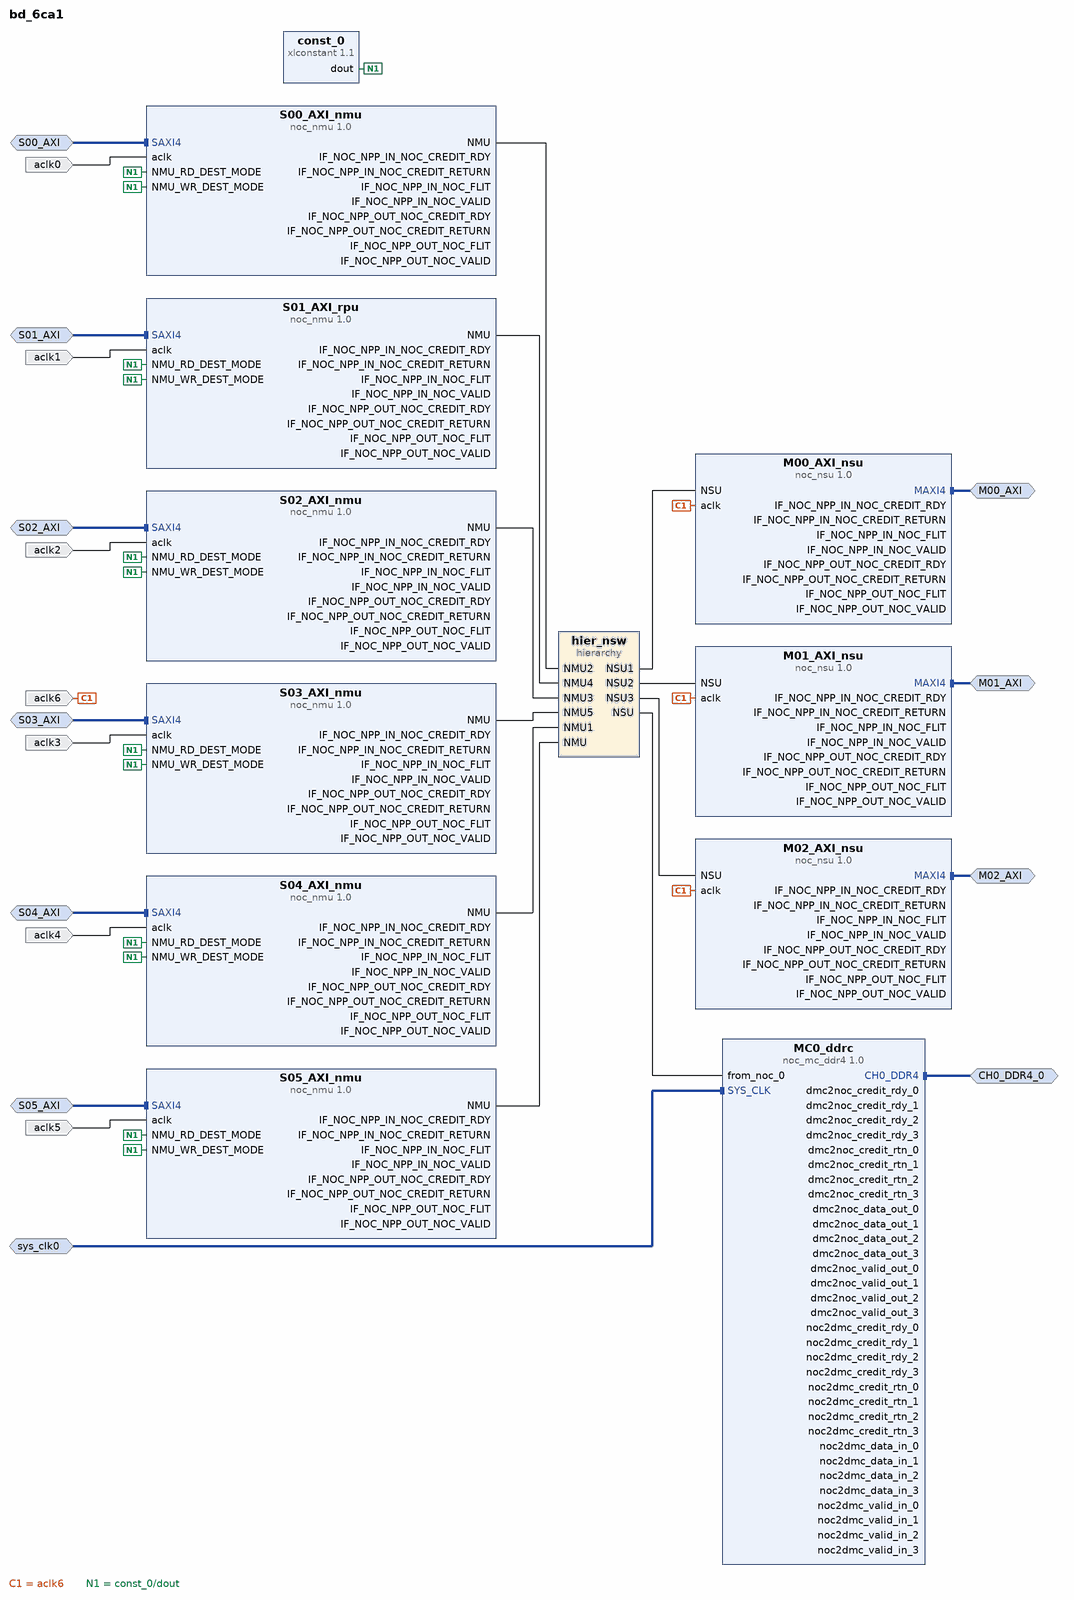
[diagram p0: block diagram of the top level]
# Vivado block design bd_6ca1, xcvc1902-vsva2197-2MP-e-S, Vivado 2021.1
create_bd_design bd_6ca1

create_bd_intf_port -mode Slave -vlnv xilinx.com:interface:aximm_rtl:1.0 S00_AXI
set_property -dict [list \
  CONFIG.CATEGORY ps_pmc \
  CONFIG.CONNECTIONS {MC_0 { read_bw {5} write_bw {5} read_avg_burst {4} write_avg_burst {4}} M00_AXI { read_bw {5} write_bw {5}}  M00_AXI {read_bw {5} write_bw {5}}} \
  CONFIG.DATA_WIDTH 128 \
  CONFIG.DEST_IDS M00_AXI:0x0 \
] [get_bd_intf_ports S00_AXI]
create_bd_intf_port -mode Slave -vlnv xilinx.com:interface:aximm_rtl:1.0 S01_AXI
set_property -dict [list \
  CONFIG.CATEGORY ps_rpu \
  CONFIG.CONNECTIONS {MC_0 { read_bw {5} write_bw {5} read_avg_burst {4} write_avg_burst {4}} } \
  CONFIG.DATA_WIDTH 128 \
] [get_bd_intf_ports S01_AXI]
create_bd_intf_port -mode Slave -vlnv xilinx.com:interface:aximm_rtl:1.0 S02_AXI
set_property -dict [list \
  CONFIG.CATEGORY ps_cci \
  CONFIG.CONNECTIONS {MC_0 { read_bw {5} write_bw {5} read_avg_burst {4} write_avg_burst {4}} M01_AXI { read_bw {5} write_bw {5} read_avg_burst {4} write_avg_burst {4}}  M02_AXI {read_bw {5} write_bw {5}}} \
  CONFIG.DATA_WIDTH 128 \
  CONFIG.DEST_IDS M01_AXI:0x40:M02_AXI:0x80 \
] [get_bd_intf_ports S02_AXI]
create_bd_intf_port -mode Slave -vlnv xilinx.com:interface:aximm_rtl:1.0 S03_AXI
set_property -dict [list \
  CONFIG.CATEGORY ps_cci \
  CONFIG.CONNECTIONS {MC_0 { read_bw {5} write_bw {5} read_avg_burst {4} write_avg_burst {4}} } \
  CONFIG.DATA_WIDTH 128 \
] [get_bd_intf_ports S03_AXI]
create_bd_intf_port -mode Slave -vlnv xilinx.com:interface:aximm_rtl:1.0 S04_AXI
set_property -dict [list \
  CONFIG.CATEGORY ps_cci \
  CONFIG.CONNECTIONS {MC_0 { read_bw {5} write_bw {5} read_avg_burst {4} write_avg_burst {4}} } \
  CONFIG.DATA_WIDTH 128 \
] [get_bd_intf_ports S04_AXI]
create_bd_intf_port -mode Slave -vlnv xilinx.com:interface:aximm_rtl:1.0 S05_AXI
set_property -dict [list \
  CONFIG.CATEGORY ps_cci \
  CONFIG.CONNECTIONS {MC_0 { read_bw {5} write_bw {5} read_avg_burst {4} write_avg_burst {4}} } \
  CONFIG.DATA_WIDTH 128 \
] [get_bd_intf_ports S05_AXI]
create_bd_intf_port -mode Master -vlnv xilinx.com:interface:aximm_rtl:1.0 M00_AXI
set_property -dict {CONFIG.APERTURES {{0x201_0000_0000 1G}} CONFIG.CATEGORY pl CONFIG.DATA_WIDTH 128} [get_bd_intf_ports M00_AXI]
create_bd_intf_port -mode Master -vlnv xilinx.com:interface:aximm_rtl:1.0 M01_AXI
set_property -dict {CONFIG.APERTURES {{0x201_4000_0000 1G}} CONFIG.CATEGORY pl CONFIG.DATA_WIDTH 32} [get_bd_intf_ports M01_AXI]
create_bd_intf_port -mode Master -vlnv xilinx.com:interface:aximm_rtl:1.0 M02_AXI
set_property -dict {CONFIG.APERTURES {{0x201_C000_0000 1G}} CONFIG.CATEGORY pl CONFIG.DATA_WIDTH 32} [get_bd_intf_ports M02_AXI]
create_bd_intf_port -mode Slave -vlnv xilinx.com:interface:diff_clock_rtl:1.0 sys_clk0
create_bd_intf_port -mode Master -vlnv xilinx.com:interface:ddr4_rtl:1.0 CH0_DDR4_0
create_bd_port -dir I -type clk aclk0
set_property -dict {CONFIG.ASSOCIATED_BUSIF S00_AXI} [get_bd_ports aclk0]
create_bd_port -dir I -type clk aclk1
set_property -dict {CONFIG.ASSOCIATED_BUSIF S01_AXI} [get_bd_ports aclk1]
create_bd_port -dir I -type clk aclk2
set_property -dict {CONFIG.ASSOCIATED_BUSIF S02_AXI} [get_bd_ports aclk2]
create_bd_port -dir I -type clk aclk3
set_property -dict {CONFIG.ASSOCIATED_BUSIF S03_AXI} [get_bd_ports aclk3]
create_bd_port -dir I -type clk aclk4
set_property -dict {CONFIG.ASSOCIATED_BUSIF S04_AXI} [get_bd_ports aclk4]
create_bd_port -dir I -type clk aclk5
set_property -dict {CONFIG.ASSOCIATED_BUSIF S05_AXI} [get_bd_ports aclk5]
create_bd_port -dir I -type clk aclk6
set_property -dict {CONFIG.ASSOCIATED_BUSIF M00_AXI:M01_AXI:M02_AXI} [get_bd_ports aclk6]

create_bd_cell -type ip -vlnv xilinx.com:ip:noc_nmu:1.0 S05_AXI_nmu
set_property -dict [list \
  CONFIG.ATTR_FILE nocattrs.dat \
  CONFIG.NOC_FREQ 1000 \
  CONFIG.USER_NOC_CATEGORY PS \
  CONFIG.USER_NOC_DATA512_WIDTH 128 \
  CONFIG.USER_NOC_NMU_WIDTH 128 \
  CONFIG.USER_PHYS_NAME NOC_NMU128_X0Y9 \
  CONFIG.USER_REG_ADDR_DST0 0x0000 \
  CONFIG.USER_REG_ADDR_DST1 0x0000 \
  CONFIG.USER_REG_ADDR_DST2 0x0000 \
  CONFIG.USER_REG_ADDR_DST3 0x0000 \
  CONFIG.USER_REG_ADDR_DST4 0x0000 \
  CONFIG.USER_REG_ADDR_DST5 0x0000 \
  CONFIG.USER_REG_ADDR_DST6 0x0000 \
  CONFIG.USER_REG_ADDR_DST7 0x0000 \
  CONFIG.USER_REG_ADDR_DST8 0x0000 \
  CONFIG.USER_REG_ADDR_DST9 0x0000 \
  CONFIG.USER_REG_ADDR_DST10 0x0000 \
  CONFIG.USER_REG_ADDR_DST11 0x0000 \
  CONFIG.USER_REG_ADDR_DST12 0x0000 \
  CONFIG.USER_REG_ADDR_DST13 0x0000 \
  CONFIG.USER_REG_ADDR_DST14 0x0000 \
  CONFIG.USER_REG_ADDR_DST15 0x0000 \
  CONFIG.USER_REG_ADDR_ENABLE 0x0000 \
  CONFIG.USER_REG_ADDR_MADDR0 0x00000000 \
  CONFIG.USER_REG_ADDR_MADDR1 0x00000000 \
  CONFIG.USER_REG_ADDR_MADDR2 0x00000000 \
  CONFIG.USER_REG_ADDR_MADDR3 0x00000000 \
  CONFIG.USER_REG_ADDR_MADDR4 0x00000000 \
  CONFIG.USER_REG_ADDR_MADDR5 0x00000000 \
  CONFIG.USER_REG_ADDR_MADDR6 0x00000000 \
  CONFIG.USER_REG_ADDR_MADDR7 0x00000000 \
  CONFIG.USER_REG_ADDR_MADDR8 0x00000000 \
  CONFIG.USER_REG_ADDR_MADDR9 0x00000000 \
  CONFIG.USER_REG_ADDR_MADDR10 0x00000000 \
  CONFIG.USER_REG_ADDR_MADDR11 0x00000000 \
  CONFIG.USER_REG_ADDR_MADDR12 0x00000000 \
  CONFIG.USER_REG_ADDR_MADDR13 0x00000000 \
  CONFIG.USER_REG_ADDR_MADDR14 0x00000000 \
  CONFIG.USER_REG_ADDR_MADDR15 0x00000000 \
  CONFIG.USER_REG_ADDR_MASK0 0x00000000 \
  CONFIG.USER_REG_ADDR_MASK1 0x00000000 \
  CONFIG.USER_REG_ADDR_MASK2 0x00000000 \
  CONFIG.USER_REG_ADDR_MASK3 0x00000000 \
  CONFIG.USER_REG_ADDR_MASK4 0x00000000 \
  CONFIG.USER_REG_ADDR_MASK5 0x00000000 \
  CONFIG.USER_REG_ADDR_MASK6 0x00000000 \
  CONFIG.USER_REG_ADDR_MASK7 0x00000000 \
  CONFIG.USER_REG_ADDR_MASK8 0x00000000 \
  CONFIG.USER_REG_ADDR_MASK9 0x00000000 \
  CONFIG.USER_REG_ADDR_MASK10 0x00000000 \
  CONFIG.USER_REG_ADDR_MASK11 0x00000000 \
  CONFIG.USER_REG_ADDR_MASK12 0x00000000 \
  CONFIG.USER_REG_ADDR_MASK13 0x00000000 \
  CONFIG.USER_REG_ADDR_MASK14 0x00000000 \
  CONFIG.USER_REG_ADDR_MASK15 0x00000000 \
  CONFIG.USER_REG_ADDR_REMAP 0x0000 \
  CONFIG.USER_REG_ADDR_RPADDR0 0x00000000 \
  CONFIG.USER_REG_ADDR_RPADDR1 0x00000000 \
  CONFIG.USER_REG_ADDR_RPADDR2 0x00000000 \
  CONFIG.USER_REG_ADDR_RPADDR3 0x00000000 \
  CONFIG.USER_REG_ADDR_RPADDR4 0x00000000 \
  CONFIG.USER_REG_ADDR_RPADDR5 0x00000000 \
  CONFIG.USER_REG_ADDR_RPADDR6 0x00000000 \
  CONFIG.USER_REG_ADDR_RPADDR7 0x00000000 \
  CONFIG.USER_REG_ADDR_RPADDR8 0x00000000 \
  CONFIG.USER_REG_ADDR_RPADDR9 0x00000000 \
  CONFIG.USER_REG_ADDR_RPADDR10 0x00000000 \
  CONFIG.USER_REG_ADDR_RPADDR11 0x00000000 \
  CONFIG.USER_REG_ADDR_RPADDR12 0x00000000 \
  CONFIG.USER_REG_ADDR_RPADDR13 0x00000000 \
  CONFIG.USER_REG_ADDR_RPADDR14 0x00000000 \
  CONFIG.USER_REG_ADDR_RPADDR15 0x00000000 \
  CONFIG.USER_REG_ADR_MAP_CPM 0xFC0 \
  CONFIG.USER_REG_ADR_MAP_FPD_AFI_0 0xFC0 \
  CONFIG.USER_REG_ADR_MAP_FPD_AFI_1 0xFC0 \
  CONFIG.USER_REG_ADR_MAP_LPD_AFI_FS 0xFC0 \
  CONFIG.USER_REG_ADR_MAP_ME_ARRAY_0 0xFC0 \
  CONFIG.USER_REG_ADR_MAP_ME_ARRAY_1 0xFC0 \
  CONFIG.USER_REG_ADR_MAP_ME_ARRAY_2 0xFC0 \
  CONFIG.USER_REG_ADR_MAP_ME_ARRAY_3 0xFC0 \
  CONFIG.USER_REG_ADR_MAP_PCIE 0xFC0 \
  CONFIG.USER_REG_ADR_MAP_PMC 0xFC0 \
  CONFIG.USER_REG_ADR_MAP_PMC_ALIAS_0 0xFC0 \
  CONFIG.USER_REG_ADR_MAP_PMC_ALIAS_1 0xFC0 \
  CONFIG.USER_REG_ADR_MAP_PMC_ALIAS_2 0xFC0 \
  CONFIG.USER_REG_ADR_MAP_PMC_ALIAS_3 0xFC0 \
  CONFIG.USER_REG_ADR_MAP_QSPI 0xFC0 \
  CONFIG.USER_REG_ADR_MAP_STM_GIC 0xFC0 \
  CONFIG.USER_REG_ADR_MAP_XPDS 0xFC0 \
  CONFIG.USER_REG_AXI_LOOPBACK 0x00 \
  CONFIG.USER_REG_AXI_NON_MOD_DISABLE 0x0 \
  CONFIG.USER_REG_AXI_PAR_CHK 0x0 \
  CONFIG.USER_REG_CHOPSIZE 0xA \
  CONFIG.USER_REG_DDR_ADR_MAP0 0x6000 \
  CONFIG.USER_REG_DDR_ADR_MAP1 0x1FFF \
  CONFIG.USER_REG_DDR_ADR_MAP2 0x1FFF \
  CONFIG.USER_REG_DDR_ADR_MAP3 0x1FFF \
  CONFIG.USER_REG_DDR_ADR_MAP4 0x1FFF \
  CONFIG.USER_REG_DDR_ADR_MAP5 0x1FFF \
  CONFIG.USER_REG_DDR_ADR_MAP6 0x1FFF \
  CONFIG.USER_REG_DDR_DST_MAP0 0x240 \
  CONFIG.USER_REG_DDR_DST_MAP1 0xFC0 \
  CONFIG.USER_REG_DDR_DST_MAP2 0xFC0 \
  CONFIG.USER_REG_DDR_DST_MAP3 0xFC0 \
  CONFIG.USER_REG_DDR_DST_MAP4 0xFC0 \
  CONFIG.USER_REG_DDR_DST_MAP5 0xFC0 \
  CONFIG.USER_REG_DDR_DST_MAP6 0xFC0 \
  CONFIG.USER_REG_DDR_DST_MAP7 0xFC0 \
  CONFIG.USER_REG_DWIDTH 0x4 \
  CONFIG.USER_REG_ECC_CHK_EN 0x1 \
  CONFIG.USER_REG_HBM_MAP_T0_CH0 0xFC0 \
  CONFIG.USER_REG_HBM_MAP_T0_CH1 0xFC0 \
  CONFIG.USER_REG_HBM_MAP_T0_CH2 0xFC0 \
  CONFIG.USER_REG_HBM_MAP_T0_CH3 0xFC0 \
  CONFIG.USER_REG_HBM_MAP_T0_CH4 0xFC0 \
  CONFIG.USER_REG_HBM_MAP_T0_CH5 0xFC0 \
  CONFIG.USER_REG_HBM_MAP_T0_CH6 0xFC0 \
  CONFIG.USER_REG_HBM_MAP_T0_CH7 0xFC0 \
  CONFIG.USER_REG_HBM_MAP_T0_CH8 0xFC0 \
  CONFIG.USER_REG_HBM_MAP_T0_CH9 0xFC0 \
  CONFIG.USER_REG_HBM_MAP_T0_CH10 0xFC0 \
  CONFIG.USER_REG_HBM_MAP_T0_CH11 0xFC0 \
  CONFIG.USER_REG_HBM_MAP_T0_CH12 0xFC0 \
  CONFIG.USER_REG_HBM_MAP_T0_CH13 0xFC0 \
  CONFIG.USER_REG_HBM_MAP_T0_CH14 0xFC0 \
  CONFIG.USER_REG_HBM_MAP_T0_CH15 0xFC0 \
  CONFIG.USER_REG_HBM_MAP_T1_CH0 0xFC0 \
  CONFIG.USER_REG_HBM_MAP_T1_CH1 0xFC0 \
  CONFIG.USER_REG_HBM_MAP_T1_CH2 0xFC0 \
  CONFIG.USER_REG_HBM_MAP_T1_CH3 0xFC0 \
  CONFIG.USER_REG_HBM_MAP_T1_CH4 0xFC0 \
  CONFIG.USER_REG_HBM_MAP_T1_CH5 0xFC0 \
  CONFIG.USER_REG_HBM_MAP_T1_CH6 0xFC0 \
  CONFIG.USER_REG_HBM_MAP_T1_CH7 0xFC0 \
  CONFIG.USER_REG_HBM_MAP_T1_CH8 0xFC0 \
  CONFIG.USER_REG_HBM_MAP_T1_CH9 0xFC0 \
  CONFIG.USER_REG_HBM_MAP_T1_CH10 0xFC0 \
  CONFIG.USER_REG_HBM_MAP_T1_CH11 0xFC0 \
  CONFIG.USER_REG_HBM_MAP_T1_CH12 0xFC0 \
  CONFIG.USER_REG_HBM_MAP_T1_CH13 0xFC0 \
  CONFIG.USER_REG_HBM_MAP_T1_CH14 0xFC0 \
  CONFIG.USER_REG_HBM_MAP_T1_CH15 0xFC0 \
  CONFIG.USER_REG_HBM_MAP_T2_CH0 0xFC0 \
  CONFIG.USER_REG_HBM_MAP_T2_CH1 0xFC0 \
  CONFIG.USER_REG_HBM_MAP_T2_CH2 0xFC0 \
  CONFIG.USER_REG_HBM_MAP_T2_CH3 0xFC0 \
  CONFIG.USER_REG_HBM_MAP_T2_CH4 0xFC0 \
  CONFIG.USER_REG_HBM_MAP_T2_CH5 0xFC0 \
  CONFIG.USER_REG_HBM_MAP_T2_CH6 0xFC0 \
  CONFIG.USER_REG_HBM_MAP_T2_CH7 0xFC0 \
  CONFIG.USER_REG_HBM_MAP_T2_CH8 0xFC0 \
  CONFIG.USER_REG_HBM_MAP_T2_CH9 0xFC0 \
  CONFIG.USER_REG_HBM_MAP_T2_CH10 0xFC0 \
  CONFIG.USER_REG_HBM_MAP_T2_CH11 0xFC0 \
  CONFIG.USER_REG_HBM_MAP_T2_CH12 0xFC0 \
  CONFIG.USER_REG_HBM_MAP_T2_CH13 0xFC0 \
  CONFIG.USER_REG_HBM_MAP_T2_CH14 0xFC0 \
  CONFIG.USER_REG_HBM_MAP_T2_CH15 0xFC0 \
  CONFIG.USER_REG_HBM_MAP_T3_CH0 0xFC0 \
  CONFIG.USER_REG_HBM_MAP_T3_CH1 0xFC0 \
  CONFIG.USER_REG_HBM_MAP_T3_CH2 0xFC0 \
  CONFIG.USER_REG_HBM_MAP_T3_CH3 0xFC0 \
  CONFIG.USER_REG_HBM_MAP_T3_CH4 0xFC0 \
  CONFIG.USER_REG_HBM_MAP_T3_CH5 0xFC0 \
  CONFIG.USER_REG_HBM_MAP_T3_CH6 0xFC0 \
  CONFIG.USER_REG_HBM_MAP_T3_CH7 0xFC0 \
  CONFIG.USER_REG_HBM_MAP_T3_CH8 0xFC0 \
  CONFIG.USER_REG_HBM_MAP_T3_CH9 0xFC0 \
  CONFIG.USER_REG_HBM_MAP_T3_CH10 0xFC0 \
  CONFIG.USER_REG_HBM_MAP_T3_CH11 0xFC0 \
  CONFIG.USER_REG_HBM_MAP_T3_CH12 0xFC0 \
  CONFIG.USER_REG_HBM_MAP_T3_CH13 0xFC0 \
  CONFIG.USER_REG_HBM_MAP_T3_CH14 0xFC0 \
  CONFIG.USER_REG_HBM_MAP_T3_CH15 0xFC0 \
  CONFIG.USER_REG_MODE_SELECT 0x0000 \
  CONFIG.USER_REG_OUTSTANDING_RD_TXN 0x40 \
  CONFIG.USER_REG_OUTSTANDING_WR_TXN 0x40 \
  CONFIG.USER_REG_PRIORITY 0x0 \
  CONFIG.USER_REG_RD_AXPROT_SEL 0x00 \
  CONFIG.USER_REG_RD_RATE_CREDIT_DROP 0x004 \
  CONFIG.USER_REG_RD_RATE_CREDIT_LIMIT 0x0100 \
  CONFIG.USER_REG_RD_VCA_TOKEN0 0x2B \
  CONFIG.USER_REG_RPOISON_TO_SLVERR 0x0 \
  CONFIG.USER_REG_RROB_RAM_SETTING 0x012 \
  CONFIG.USER_REG_SMID_SEL 0x00000 \
  CONFIG.USER_REG_SRC 0x200 \
  CONFIG.USER_REG_TBASE_AXI_TIMEOUT 0x1 \
  CONFIG.USER_REG_TBASE_MODE_RLIMIT_RD 0x2 \
  CONFIG.USER_REG_TBASE_MODE_RLIMIT_WR 0x2 \
  CONFIG.USER_REG_TBASE_TRK_TIMEOUT 0x1 \
  CONFIG.USER_REG_VC_MAP 0xFAC \
  CONFIG.USER_REG_WBUF_LAUNCH_SIZE 0x10 \
  CONFIG.USER_REG_WBUF_RAM_SETTING 0x012 \
  CONFIG.USER_REG_WR_AXPROT_SEL 0x00 \
  CONFIG.USER_REG_WR_RATE_CREDIT_DROP 0x004 \
  CONFIG.USER_REG_WR_RATE_CREDIT_LIMIT 0x0100 \
  CONFIG.USER_REG_WR_VCA_TOKEN0 0xFF \
] [get_bd_cells S05_AXI_nmu]
create_bd_cell -type ip -vlnv xilinx.com:ip:xlconstant:1.1 const_0
set_property -dict {CONFIG.CONST_VAL 0 CONFIG.CONST_WIDTH 1} [get_bd_cells const_0]
create_bd_cell -type ip -vlnv xilinx.com:ip:noc_nmu:1.0 S04_AXI_nmu
set_property -dict [list \
  CONFIG.ATTR_FILE nocattrs.dat \
  CONFIG.NOC_FREQ 1000 \
  CONFIG.USER_NOC_CATEGORY PS \
  CONFIG.USER_NOC_DATA512_WIDTH 128 \
  CONFIG.USER_NOC_NMU_WIDTH 128 \
  CONFIG.USER_PHYS_NAME NOC_NMU128_X0Y8 \
  CONFIG.USER_REG_ADDR_DST0 0x0000 \
  CONFIG.USER_REG_ADDR_DST1 0x0000 \
  CONFIG.USER_REG_ADDR_DST2 0x0000 \
  CONFIG.USER_REG_ADDR_DST3 0x0000 \
  CONFIG.USER_REG_ADDR_DST4 0x0000 \
  CONFIG.USER_REG_ADDR_DST5 0x0000 \
  CONFIG.USER_REG_ADDR_DST6 0x0000 \
  CONFIG.USER_REG_ADDR_DST7 0x0000 \
  CONFIG.USER_REG_ADDR_DST8 0x0000 \
  CONFIG.USER_REG_ADDR_DST9 0x0000 \
  CONFIG.USER_REG_ADDR_DST10 0x0000 \
  CONFIG.USER_REG_ADDR_DST11 0x0000 \
  CONFIG.USER_REG_ADDR_DST12 0x0000 \
  CONFIG.USER_REG_ADDR_DST13 0x0000 \
  CONFIG.USER_REG_ADDR_DST14 0x0000 \
  CONFIG.USER_REG_ADDR_DST15 0x0000 \
  CONFIG.USER_REG_ADDR_ENABLE 0x0000 \
  CONFIG.USER_REG_ADDR_MADDR0 0x00000000 \
  CONFIG.USER_REG_ADDR_MADDR1 0x00000000 \
  CONFIG.USER_REG_ADDR_MADDR2 0x00000000 \
  CONFIG.USER_REG_ADDR_MADDR3 0x00000000 \
  CONFIG.USER_REG_ADDR_MADDR4 0x00000000 \
  CONFIG.USER_REG_ADDR_MADDR5 0x00000000 \
  CONFIG.USER_REG_ADDR_MADDR6 0x00000000 \
  CONFIG.USER_REG_ADDR_MADDR7 0x00000000 \
  CONFIG.USER_REG_ADDR_MADDR8 0x00000000 \
  CONFIG.USER_REG_ADDR_MADDR9 0x00000000 \
  CONFIG.USER_REG_ADDR_MADDR10 0x00000000 \
  CONFIG.USER_REG_ADDR_MADDR11 0x00000000 \
  CONFIG.USER_REG_ADDR_MADDR12 0x00000000 \
  CONFIG.USER_REG_ADDR_MADDR13 0x00000000 \
  CONFIG.USER_REG_ADDR_MADDR14 0x00000000 \
  CONFIG.USER_REG_ADDR_MADDR15 0x00000000 \
  CONFIG.USER_REG_ADDR_MASK0 0x00000000 \
  CONFIG.USER_REG_ADDR_MASK1 0x00000000 \
  CONFIG.USER_REG_ADDR_MASK2 0x00000000 \
  CONFIG.USER_REG_ADDR_MASK3 0x00000000 \
  CONFIG.USER_REG_ADDR_MASK4 0x00000000 \
  CONFIG.USER_REG_ADDR_MASK5 0x00000000 \
  CONFIG.USER_REG_ADDR_MASK6 0x00000000 \
  CONFIG.USER_REG_ADDR_MASK7 0x00000000 \
  CONFIG.USER_REG_ADDR_MASK8 0x00000000 \
  CONFIG.USER_REG_ADDR_MASK9 0x00000000 \
  CONFIG.USER_REG_ADDR_MASK10 0x00000000 \
  CONFIG.USER_REG_ADDR_MASK11 0x00000000 \
  CONFIG.USER_REG_ADDR_MASK12 0x00000000 \
  CONFIG.USER_REG_ADDR_MASK13 0x00000000 \
  CONFIG.USER_REG_ADDR_MASK14 0x00000000 \
  CONFIG.USER_REG_ADDR_MASK15 0x00000000 \
  CONFIG.USER_REG_ADDR_REMAP 0x0000 \
  CONFIG.USER_REG_ADDR_RPADDR0 0x00000000 \
  CONFIG.USER_REG_ADDR_RPADDR1 0x00000000 \
  CONFIG.USER_REG_ADDR_RPADDR2 0x00000000 \
  CONFIG.USER_REG_ADDR_RPADDR3 0x00000000 \
  CONFIG.USER_REG_ADDR_RPADDR4 0x00000000 \
  CONFIG.USER_REG_ADDR_RPADDR5 0x00000000 \
  CONFIG.USER_REG_ADDR_RPADDR6 0x00000000 \
  CONFIG.USER_REG_ADDR_RPADDR7 0x00000000 \
  CONFIG.USER_REG_ADDR_RPADDR8 0x00000000 \
  CONFIG.USER_REG_ADDR_RPADDR9 0x00000000 \
  CONFIG.USER_REG_ADDR_RPADDR10 0x00000000 \
  CONFIG.USER_REG_ADDR_RPADDR11 0x00000000 \
  CONFIG.USER_REG_ADDR_RPADDR12 0x00000000 \
  CONFIG.USER_REG_ADDR_RPADDR13 0x00000000 \
  CONFIG.USER_REG_ADDR_RPADDR14 0x00000000 \
  CONFIG.USER_REG_ADDR_RPADDR15 0x00000000 \
  CONFIG.USER_REG_ADR_MAP_CPM 0xFC0 \
  CONFIG.USER_REG_ADR_MAP_FPD_AFI_0 0xFC0 \
  CONFIG.USER_REG_ADR_MAP_FPD_AFI_1 0xFC0 \
  CONFIG.USER_REG_ADR_MAP_LPD_AFI_FS 0xFC0 \
  CONFIG.USER_REG_ADR_MAP_ME_ARRAY_0 0xFC0 \
  CONFIG.USER_REG_ADR_MAP_ME_ARRAY_1 0xFC0 \
  CONFIG.USER_REG_ADR_MAP_ME_ARRAY_2 0xFC0 \
  CONFIG.USER_REG_ADR_MAP_ME_ARRAY_3 0xFC0 \
  CONFIG.USER_REG_ADR_MAP_PCIE 0xFC0 \
  CONFIG.USER_REG_ADR_MAP_PMC 0xFC0 \
  CONFIG.USER_REG_ADR_MAP_PMC_ALIAS_0 0xFC0 \
  CONFIG.USER_REG_ADR_MAP_PMC_ALIAS_1 0xFC0 \
  CONFIG.USER_REG_ADR_MAP_PMC_ALIAS_2 0xFC0 \
  CONFIG.USER_REG_ADR_MAP_PMC_ALIAS_3 0xFC0 \
  CONFIG.USER_REG_ADR_MAP_QSPI 0xFC0 \
  CONFIG.USER_REG_ADR_MAP_STM_GIC 0xFC0 \
  CONFIG.USER_REG_ADR_MAP_XPDS 0xFC0 \
  CONFIG.USER_REG_AXI_LOOPBACK 0x00 \
  CONFIG.USER_REG_AXI_NON_MOD_DISABLE 0x0 \
  CONFIG.USER_REG_AXI_PAR_CHK 0x0 \
  CONFIG.USER_REG_CHOPSIZE 0xA \
  CONFIG.USER_REG_DDR_ADR_MAP0 0x6000 \
  CONFIG.USER_REG_DDR_ADR_MAP1 0x1FFF \
  CONFIG.USER_REG_DDR_ADR_MAP2 0x1FFF \
  CONFIG.USER_REG_DDR_ADR_MAP3 0x1FFF \
  CONFIG.USER_REG_DDR_ADR_MAP4 0x1FFF \
  CONFIG.USER_REG_DDR_ADR_MAP5 0x1FFF \
  CONFIG.USER_REG_DDR_ADR_MAP6 0x1FFF \
  CONFIG.USER_REG_DDR_DST_MAP0 0x240 \
  CONFIG.USER_REG_DDR_DST_MAP1 0xFC0 \
  CONFIG.USER_REG_DDR_DST_MAP2 0xFC0 \
  CONFIG.USER_REG_DDR_DST_MAP3 0xFC0 \
  CONFIG.USER_REG_DDR_DST_MAP4 0xFC0 \
  CONFIG.USER_REG_DDR_DST_MAP5 0xFC0 \
  CONFIG.USER_REG_DDR_DST_MAP6 0xFC0 \
  CONFIG.USER_REG_DDR_DST_MAP7 0xFC0 \
  CONFIG.USER_REG_DWIDTH 0x4 \
  CONFIG.USER_REG_ECC_CHK_EN 0x1 \
  CONFIG.USER_REG_HBM_MAP_T0_CH0 0xFC0 \
  CONFIG.USER_REG_HBM_MAP_T0_CH1 0xFC0 \
  CONFIG.USER_REG_HBM_MAP_T0_CH2 0xFC0 \
  CONFIG.USER_REG_HBM_MAP_T0_CH3 0xFC0 \
  CONFIG.USER_REG_HBM_MAP_T0_CH4 0xFC0 \
  CONFIG.USER_REG_HBM_MAP_T0_CH5 0xFC0 \
  CONFIG.USER_REG_HBM_MAP_T0_CH6 0xFC0 \
  CONFIG.USER_REG_HBM_MAP_T0_CH7 0xFC0 \
  CONFIG.USER_REG_HBM_MAP_T0_CH8 0xFC0 \
  CONFIG.USER_REG_HBM_MAP_T0_CH9 0xFC0 \
  CONFIG.USER_REG_HBM_MAP_T0_CH10 0xFC0 \
  CONFIG.USER_REG_HBM_MAP_T0_CH11 0xFC0 \
  CONFIG.USER_REG_HBM_MAP_T0_CH12 0xFC0 \
  CONFIG.USER_REG_HBM_MAP_T0_CH13 0xFC0 \
  CONFIG.USER_REG_HBM_MAP_T0_CH14 0xFC0 \
  CONFIG.USER_REG_HBM_MAP_T0_CH15 0xFC0 \
  CONFIG.USER_REG_HBM_MAP_T1_CH0 0xFC0 \
  CONFIG.USER_REG_HBM_MAP_T1_CH1 0xFC0 \
  CONFIG.USER_REG_HBM_MAP_T1_CH2 0xFC0 \
  CONFIG.USER_REG_HBM_MAP_T1_CH3 0xFC0 \
  CONFIG.USER_REG_HBM_MAP_T1_CH4 0xFC0 \
  CONFIG.USER_REG_HBM_MAP_T1_CH5 0xFC0 \
  CONFIG.USER_REG_HBM_MAP_T1_CH6 0xFC0 \
  CONFIG.USER_REG_HBM_MAP_T1_CH7 0xFC0 \
  CONFIG.USER_REG_HBM_MAP_T1_CH8 0xFC0 \
  CONFIG.USER_REG_HBM_MAP_T1_CH9 0xFC0 \
  CONFIG.USER_REG_HBM_MAP_T1_CH10 0xFC0 \
  CONFIG.USER_REG_HBM_MAP_T1_CH11 0xFC0 \
  CONFIG.USER_REG_HBM_MAP_T1_CH12 0xFC0 \
  CONFIG.USER_REG_HBM_MAP_T1_CH13 0xFC0 \
  CONFIG.USER_REG_HBM_MAP_T1_CH14 0xFC0 \
  CONFIG.USER_REG_HBM_MAP_T1_CH15 0xFC0 \
  CONFIG.USER_REG_HBM_MAP_T2_CH0 0xFC0 \
  CONFIG.USER_REG_HBM_MAP_T2_CH1 0xFC0 \
  CONFIG.USER_REG_HBM_MAP_T2_CH2 0xFC0 \
  CONFIG.USER_REG_HBM_MAP_T2_CH3 0xFC0 \
  CONFIG.USER_REG_HBM_MAP_T2_CH4 0xFC0 \
  CONFIG.USER_REG_HBM_MAP_T2_CH5 0xFC0 \
  CONFIG.USER_REG_HBM_MAP_T2_CH6 0xFC0 \
  CONFIG.USER_REG_HBM_MAP_T2_CH7 0xFC0 \
  CONFIG.USER_REG_HBM_MAP_T2_CH8 0xFC0 \
  CONFIG.USER_REG_HBM_MAP_T2_CH9 0xFC0 \
  CONFIG.USER_REG_HBM_MAP_T2_CH10 0xFC0 \
  CONFIG.USER_REG_HBM_MAP_T2_CH11 0xFC0 \
  CONFIG.USER_REG_HBM_MAP_T2_CH12 0xFC0 \
  CONFIG.USER_REG_HBM_MAP_T2_CH13 0xFC0 \
  CONFIG.USER_REG_HBM_MAP_T2_CH14 0xFC0 \
  CONFIG.USER_REG_HBM_MAP_T2_CH15 0xFC0 \
  CONFIG.USER_REG_HBM_MAP_T3_CH0 0xFC0 \
  CONFIG.USER_REG_HBM_MAP_T3_CH1 0xFC0 \
  CONFIG.USER_REG_HBM_MAP_T3_CH2 0xFC0 \
  CONFIG.USER_REG_HBM_MAP_T3_CH3 0xFC0 \
  CONFIG.USER_REG_HBM_MAP_T3_CH4 0xFC0 \
  CONFIG.USER_REG_HBM_MAP_T3_CH5 0xFC0 \
  CONFIG.USER_REG_HBM_MAP_T3_CH6 0xFC0 \
  CONFIG.USER_REG_HBM_MAP_T3_CH7 0xFC0 \
  CONFIG.USER_REG_HBM_MAP_T3_CH8 0xFC0 \
  CONFIG.USER_REG_HBM_MAP_T3_CH9 0xFC0 \
  CONFIG.USER_REG_HBM_MAP_T3_CH10 0xFC0 \
  CONFIG.USER_REG_HBM_MAP_T3_CH11 0xFC0 \
  CONFIG.USER_REG_HBM_MAP_T3_CH12 0xFC0 \
  CONFIG.USER_REG_HBM_MAP_T3_CH13 0xFC0 \
  CONFIG.USER_REG_HBM_MAP_T3_CH14 0xFC0 \
  CONFIG.USER_REG_HBM_MAP_T3_CH15 0xFC0 \
  CONFIG.USER_REG_MODE_SELECT 0x0000 \
  CONFIG.USER_REG_OUTSTANDING_RD_TXN 0x40 \
  CONFIG.USER_REG_OUTSTANDING_WR_TXN 0x40 \
  CONFIG.USER_REG_PRIORITY 0x0 \
  CONFIG.USER_REG_RD_AXPROT_SEL 0x00 \
  CONFIG.USER_REG_RD_RATE_CREDIT_DROP 0x004 \
  CONFIG.USER_REG_RD_RATE_CREDIT_LIMIT 0x0100 \
  CONFIG.USER_REG_RD_VCA_TOKEN0 0x2B \
  CONFIG.USER_REG_RPOISON_TO_SLVERR 0x0 \
  CONFIG.USER_REG_RROB_RAM_SETTING 0x012 \
  CONFIG.USER_REG_SMID_SEL 0x00000 \
  CONFIG.USER_REG_SRC 0x1C0 \
  CONFIG.USER_REG_TBASE_AXI_TIMEOUT 0x1 \
  CONFIG.USER_REG_TBASE_MODE_RLIMIT_RD 0x2 \
  CONFIG.USER_REG_TBASE_MODE_RLIMIT_WR 0x2 \
  CONFIG.USER_REG_TBASE_TRK_TIMEOUT 0x1 \
  CONFIG.USER_REG_VC_MAP 0xFAC \
  CONFIG.USER_REG_WBUF_LAUNCH_SIZE 0x10 \
  CONFIG.USER_REG_WBUF_RAM_SETTING 0x012 \
  CONFIG.USER_REG_WR_AXPROT_SEL 0x00 \
  CONFIG.USER_REG_WR_RATE_CREDIT_DROP 0x004 \
  CONFIG.USER_REG_WR_RATE_CREDIT_LIMIT 0x0100 \
  CONFIG.USER_REG_WR_VCA_TOKEN0 0xFF \
] [get_bd_cells S04_AXI_nmu]
create_bd_cell -type ip -vlnv xilinx.com:ip:noc_nmu:1.0 S00_AXI_nmu
set_property -dict [list \
  CONFIG.ATTR_FILE nocattrs.dat \
  CONFIG.NOC_FREQ 1000 \
  CONFIG.USER_NOC_CATEGORY PS \
  CONFIG.USER_NOC_DATA512_WIDTH 128 \
  CONFIG.USER_NOC_NMU_WIDTH 128 \
  CONFIG.USER_PHYS_NAME NOC_NMU128_X0Y2 \
  CONFIG.USER_REG_ADDR_DST0 0x0000 \
  CONFIG.USER_REG_ADDR_DST1 0x0000 \
  CONFIG.USER_REG_ADDR_DST2 0x0000 \
  CONFIG.USER_REG_ADDR_DST3 0x0000 \
  CONFIG.USER_REG_ADDR_DST4 0x0000 \
  CONFIG.USER_REG_ADDR_DST5 0x0000 \
  CONFIG.USER_REG_ADDR_DST6 0x0000 \
  CONFIG.USER_REG_ADDR_DST7 0x0000 \
  CONFIG.USER_REG_ADDR_DST8 0x0000 \
  CONFIG.USER_REG_ADDR_DST9 0x0000 \
  CONFIG.USER_REG_ADDR_DST10 0x0000 \
  CONFIG.USER_REG_ADDR_DST11 0x0000 \
  CONFIG.USER_REG_ADDR_DST12 0x0000 \
  CONFIG.USER_REG_ADDR_DST13 0x0000 \
  CONFIG.USER_REG_ADDR_DST14 0x0000 \
  CONFIG.USER_REG_ADDR_DST15 0x0000 \
  CONFIG.USER_REG_ADDR_ENABLE 0x0001 \
  CONFIG.USER_REG_ADDR_MADDR0 0x02010000 \
  CONFIG.USER_REG_ADDR_MADDR1 0x00000000 \
  CONFIG.USER_REG_ADDR_MADDR2 0x00000000 \
  CONFIG.USER_REG_ADDR_MADDR3 0x00000000 \
  CONFIG.USER_REG_ADDR_MADDR4 0x00000000 \
  CONFIG.USER_REG_ADDR_MADDR5 0x00000000 \
  CONFIG.USER_REG_ADDR_MADDR6 0x00000000 \
  CONFIG.USER_REG_ADDR_MADDR7 0x00000000 \
  CONFIG.USER_REG_ADDR_MADDR8 0x00000000 \
  CONFIG.USER_REG_ADDR_MADDR9 0x00000000 \
  CONFIG.USER_REG_ADDR_MADDR10 0x00000000 \
  CONFIG.USER_REG_ADDR_MADDR11 0x00000000 \
  CONFIG.USER_REG_ADDR_MADDR12 0x00000000 \
  CONFIG.USER_REG_ADDR_MADDR13 0x00000000 \
  CONFIG.USER_REG_ADDR_MADDR14 0x00000000 \
  CONFIG.USER_REG_ADDR_MADDR15 0x00000000 \
  CONFIG.USER_REG_ADDR_MASK0 0xffffffe0 \
  CONFIG.USER_REG_ADDR_MASK1 0x00000000 \
  CONFIG.USER_REG_ADDR_MASK2 0x00000000 \
  CONFIG.USER_REG_ADDR_MASK3 0x00000000 \
  CONFIG.USER_REG_ADDR_MASK4 0x00000000 \
  CONFIG.USER_REG_ADDR_MASK5 0x00000000 \
  CONFIG.USER_REG_ADDR_MASK6 0x00000000 \
  CONFIG.USER_REG_ADDR_MASK7 0x00000000 \
  CONFIG.USER_REG_ADDR_MASK8 0x00000000 \
  CONFIG.USER_REG_ADDR_MASK9 0x00000000 \
  CONFIG.USER_REG_ADDR_MASK10 0x00000000 \
  CONFIG.USER_REG_ADDR_MASK11 0x00000000 \
  CONFIG.USER_REG_ADDR_MASK12 0x00000000 \
  CONFIG.USER_REG_ADDR_MASK13 0x00000000 \
  CONFIG.USER_REG_ADDR_MASK14 0x00000000 \
  CONFIG.USER_REG_ADDR_MASK15 0x00000000 \
  CONFIG.USER_REG_ADDR_REMAP 0x0001 \
  CONFIG.USER_REG_ADDR_RPADDR0 0x02010000 \
  CONFIG.USER_REG_ADDR_RPADDR1 0x00000000 \
  CONFIG.USER_REG_ADDR_RPADDR2 0x00000000 \
  CONFIG.USER_REG_ADDR_RPADDR3 0x00000000 \
  CONFIG.USER_REG_ADDR_RPADDR4 0x00000000 \
  CONFIG.USER_REG_ADDR_RPADDR5 0x00000000 \
  CONFIG.USER_REG_ADDR_RPADDR6 0x00000000 \
  CONFIG.USER_REG_ADDR_RPADDR7 0x00000000 \
  CONFIG.USER_REG_ADDR_RPADDR8 0x00000000 \
  CONFIG.USER_REG_ADDR_RPADDR9 0x00000000 \
  CONFIG.USER_REG_ADDR_RPADDR10 0x00000000 \
  CONFIG.USER_REG_ADDR_RPADDR11 0x00000000 \
  CONFIG.USER_REG_ADDR_RPADDR12 0x00000000 \
  CONFIG.USER_REG_ADDR_RPADDR13 0x00000000 \
  CONFIG.USER_REG_ADDR_RPADDR14 0x00000000 \
  CONFIG.USER_REG_ADDR_RPADDR15 0x00000000 \
  CONFIG.USER_REG_ADR_MAP_CPM 0xFC0 \
  CONFIG.USER_REG_ADR_MAP_FPD_AFI_0 0xFC0 \
  CONFIG.USER_REG_ADR_MAP_FPD_AFI_1 0xFC0 \
  CONFIG.USER_REG_ADR_MAP_LPD_AFI_FS 0xFC0 \
  CONFIG.USER_REG_ADR_MAP_ME_ARRAY_0 0xFC0 \
  CONFIG.USER_REG_ADR_MAP_ME_ARRAY_1 0xFC0 \
  CONFIG.USER_REG_ADR_MAP_ME_ARRAY_2 0xFC0 \
  CONFIG.USER_REG_ADR_MAP_ME_ARRAY_3 0xFC0 \
  CONFIG.USER_REG_ADR_MAP_PCIE 0xFC0 \
  CONFIG.USER_REG_ADR_MAP_PMC 0xFC0 \
  CONFIG.USER_REG_ADR_MAP_PMC_ALIAS_0 0xFC0 \
  CONFIG.USER_REG_ADR_MAP_PMC_ALIAS_1 0xFC0 \
  CONFIG.USER_REG_ADR_MAP_PMC_ALIAS_2 0xFC0 \
  CONFIG.USER_REG_ADR_MAP_PMC_ALIAS_3 0xFC0 \
  CONFIG.USER_REG_ADR_MAP_QSPI 0xFC0 \
  CONFIG.USER_REG_ADR_MAP_STM_GIC 0xFC0 \
  CONFIG.USER_REG_ADR_MAP_XPDS 0xFC0 \
  CONFIG.USER_REG_AXI_LOOPBACK 0x00 \
  CONFIG.USER_REG_AXI_NON_MOD_DISABLE 0x0 \
  CONFIG.USER_REG_AXI_PAR_CHK 0x0 \
  CONFIG.USER_REG_CHOPSIZE 0xA \
  CONFIG.USER_REG_DDR_ADR_MAP0 0x6000 \
  CONFIG.USER_REG_DDR_ADR_MAP1 0x1FFF \
  CONFIG.USER_REG_DDR_ADR_MAP2 0x1FFF \
  CONFIG.USER_REG_DDR_ADR_MAP3 0x1FFF \
  CONFIG.USER_REG_DDR_ADR_MAP4 0x1FFF \
  CONFIG.USER_REG_DDR_ADR_MAP5 0x1FFF \
  CONFIG.USER_REG_DDR_ADR_MAP6 0x1FFF \
  CONFIG.USER_REG_DDR_DST_MAP0 0x240 \
  CONFIG.USER_REG_DDR_DST_MAP1 0xFC0 \
  CONFIG.USER_REG_DDR_DST_MAP2 0xFC0 \
  CONFIG.USER_REG_DDR_DST_MAP3 0xFC0 \
  CONFIG.USER_REG_DDR_DST_MAP4 0xFC0 \
  CONFIG.USER_REG_DDR_DST_MAP5 0xFC0 \
  CONFIG.USER_REG_DDR_DST_MAP6 0xFC0 \
  CONFIG.USER_REG_DDR_DST_MAP7 0xFC0 \
  CONFIG.USER_REG_DWIDTH 0x4 \
  CONFIG.USER_REG_ECC_CHK_EN 0x1 \
  CONFIG.USER_REG_HBM_MAP_T0_CH0 0xFC0 \
  CONFIG.USER_REG_HBM_MAP_T0_CH1 0xFC0 \
  CONFIG.USER_REG_HBM_MAP_T0_CH2 0xFC0 \
  CONFIG.USER_REG_HBM_MAP_T0_CH3 0xFC0 \
  CONFIG.USER_REG_HBM_MAP_T0_CH4 0xFC0 \
  CONFIG.USER_REG_HBM_MAP_T0_CH5 0xFC0 \
  CONFIG.USER_REG_HBM_MAP_T0_CH6 0xFC0 \
  CONFIG.USER_REG_HBM_MAP_T0_CH7 0xFC0 \
  CONFIG.USER_REG_HBM_MAP_T0_CH8 0xFC0 \
  CONFIG.USER_REG_HBM_MAP_T0_CH9 0xFC0 \
  CONFIG.USER_REG_HBM_MAP_T0_CH10 0xFC0 \
  CONFIG.USER_REG_HBM_MAP_T0_CH11 0xFC0 \
  CONFIG.USER_REG_HBM_MAP_T0_CH12 0xFC0 \
  CONFIG.USER_REG_HBM_MAP_T0_CH13 0xFC0 \
  CONFIG.USER_REG_HBM_MAP_T0_CH14 0xFC0 \
  CONFIG.USER_REG_HBM_MAP_T0_CH15 0xFC0 \
  CONFIG.USER_REG_HBM_MAP_T1_CH0 0xFC0 \
  CONFIG.USER_REG_HBM_MAP_T1_CH1 0xFC0 \
  CONFIG.USER_REG_HBM_MAP_T1_CH2 0xFC0 \
  CONFIG.USER_REG_HBM_MAP_T1_CH3 0xFC0 \
  CONFIG.USER_REG_HBM_MAP_T1_CH4 0xFC0 \
  CONFIG.USER_REG_HBM_MAP_T1_CH5 0xFC0 \
  CONFIG.USER_REG_HBM_MAP_T1_CH6 0xFC0 \
  CONFIG.USER_REG_HBM_MAP_T1_CH7 0xFC0 \
  CONFIG.USER_REG_HBM_MAP_T1_CH8 0xFC0 \
  CONFIG.USER_REG_HBM_MAP_T1_CH9 0xFC0 \
  CONFIG.USER_REG_HBM_MAP_T1_CH10 0xFC0 \
  CONFIG.USER_REG_HBM_MAP_T1_CH11 0xFC0 \
  CONFIG.USER_REG_HBM_MAP_T1_CH12 0xFC0 \
  CONFIG.USER_REG_HBM_MAP_T1_CH13 0xFC0 \
  CONFIG.USER_REG_HBM_MAP_T1_CH14 0xFC0 \
  CONFIG.USER_REG_HBM_MAP_T1_CH15 0xFC0 \
  CONFIG.USER_REG_HBM_MAP_T2_CH0 0xFC0 \
  CONFIG.USER_REG_HBM_MAP_T2_CH1 0xFC0 \
  CONFIG.USER_REG_HBM_MAP_T2_CH2 0xFC0 \
  CONFIG.USER_REG_HBM_MAP_T2_CH3 0xFC0 \
  CONFIG.USER_REG_HBM_MAP_T2_CH4 0xFC0 \
  CONFIG.USER_REG_HBM_MAP_T2_CH5 0xFC0 \
  CONFIG.USER_REG_HBM_MAP_T2_CH6 0xFC0 \
  CONFIG.USER_REG_HBM_MAP_T2_CH7 0xFC0 \
  CONFIG.USER_REG_HBM_MAP_T2_CH8 0xFC0 \
  CONFIG.USER_REG_HBM_MAP_T2_CH9 0xFC0 \
  CONFIG.USER_REG_HBM_MAP_T2_CH10 0xFC0 \
  CONFIG.USER_REG_HBM_MAP_T2_CH11 0xFC0 \
  CONFIG.USER_REG_HBM_MAP_T2_CH12 0xFC0 \
  CONFIG.USER_REG_HBM_MAP_T2_CH13 0xFC0 \
  CONFIG.USER_REG_HBM_MAP_T2_CH14 0xFC0 \
  CONFIG.USER_REG_HBM_MAP_T2_CH15 0xFC0 \
  CONFIG.USER_REG_HBM_MAP_T3_CH0 0xFC0 \
  CONFIG.USER_REG_HBM_MAP_T3_CH1 0xFC0 \
  CONFIG.USER_REG_HBM_MAP_T3_CH2 0xFC0 \
  CONFIG.USER_REG_HBM_MAP_T3_CH3 0xFC0 \
  CONFIG.USER_REG_HBM_MAP_T3_CH4 0xFC0 \
  CONFIG.USER_REG_HBM_MAP_T3_CH5 0xFC0 \
  CONFIG.USER_REG_HBM_MAP_T3_CH6 0xFC0 \
  CONFIG.USER_REG_HBM_MAP_T3_CH7 0xFC0 \
  CONFIG.USER_REG_HBM_MAP_T3_CH8 0xFC0 \
  CONFIG.USER_REG_HBM_MAP_T3_CH9 0xFC0 \
  CONFIG.USER_REG_HBM_MAP_T3_CH10 0xFC0 \
  CONFIG.USER_REG_HBM_MAP_T3_CH11 0xFC0 \
  CONFIG.USER_REG_HBM_MAP_T3_CH12 0xFC0 \
  CONFIG.USER_REG_HBM_MAP_T3_CH13 0xFC0 \
  CONFIG.USER_REG_HBM_MAP_T3_CH14 0xFC0 \
  CONFIG.USER_REG_HBM_MAP_T3_CH15 0xFC0 \
  CONFIG.USER_REG_MODE_SELECT 0x0000 \
  CONFIG.USER_REG_OUTSTANDING_RD_TXN 0x40 \
  CONFIG.USER_REG_OUTSTANDING_WR_TXN 0x40 \
  CONFIG.USER_REG_PRIORITY 0x0 \
  CONFIG.USER_REG_RD_AXPROT_SEL 0x00 \
  CONFIG.USER_REG_RD_RATE_CREDIT_DROP 0x004 \
  CONFIG.USER_REG_RD_RATE_CREDIT_LIMIT 0x0100 \
  CONFIG.USER_REG_RD_VCA_TOKEN0 0x2B \
  CONFIG.USER_REG_RPOISON_TO_SLVERR 0x0 \
  CONFIG.USER_REG_RROB_RAM_SETTING 0x012 \
  CONFIG.USER_REG_SMID_SEL 0x00000 \
  CONFIG.USER_REG_SRC 0x0C0 \
  CONFIG.USER_REG_TBASE_AXI_TIMEOUT 0x1 \
  CONFIG.USER_REG_TBASE_MODE_RLIMIT_RD 0x2 \
  CONFIG.USER_REG_TBASE_MODE_RLIMIT_WR 0x2 \
  CONFIG.USER_REG_TBASE_TRK_TIMEOUT 0x1 \
  CONFIG.USER_REG_VC_MAP 0xFAC \
  CONFIG.USER_REG_WBUF_LAUNCH_SIZE 0x10 \
  CONFIG.USER_REG_WBUF_RAM_SETTING 0x012 \
  CONFIG.USER_REG_WR_AXPROT_SEL 0x00 \
  CONFIG.USER_REG_WR_RATE_CREDIT_DROP 0x004 \
  CONFIG.USER_REG_WR_RATE_CREDIT_LIMIT 0x0100 \
  CONFIG.USER_REG_WR_VCA_TOKEN0 0xFF \
] [get_bd_cells S00_AXI_nmu]
create_bd_cell -type ip -vlnv xilinx.com:ip:noc_nmu:1.0 S02_AXI_nmu
set_property -dict [list \
  CONFIG.ATTR_FILE nocattrs.dat \
  CONFIG.NOC_FREQ 1000 \
  CONFIG.USER_NOC_CATEGORY PS \
  CONFIG.USER_NOC_DATA512_WIDTH 128 \
  CONFIG.USER_NOC_NMU_WIDTH 128 \
  CONFIG.USER_PHYS_NAME NOC_NMU128_X0Y6 \
  CONFIG.USER_REG_ADDR_DST0 0x0040 \
  CONFIG.USER_REG_ADDR_DST1 0x0080 \
  CONFIG.USER_REG_ADDR_DST2 0x0000 \
  CONFIG.USER_REG_ADDR_DST3 0x0000 \
  CONFIG.USER_REG_ADDR_DST4 0x0000 \
  CONFIG.USER_REG_ADDR_DST5 0x0000 \
  CONFIG.USER_REG_ADDR_DST6 0x0000 \
  CONFIG.USER_REG_ADDR_DST7 0x0000 \
  CONFIG.USER_REG_ADDR_DST8 0x0000 \
  CONFIG.USER_REG_ADDR_DST9 0x0000 \
  CONFIG.USER_REG_ADDR_DST10 0x0000 \
  CONFIG.USER_REG_ADDR_DST11 0x0000 \
  CONFIG.USER_REG_ADDR_DST12 0x0000 \
  CONFIG.USER_REG_ADDR_DST13 0x0000 \
  CONFIG.USER_REG_ADDR_DST14 0x0000 \
  CONFIG.USER_REG_ADDR_DST15 0x0000 \
  CONFIG.USER_REG_ADDR_ENABLE 0x0003 \
  CONFIG.USER_REG_ADDR_MADDR0 0x02014000 \
  CONFIG.USER_REG_ADDR_MADDR1 0x0201c000 \
  CONFIG.USER_REG_ADDR_MADDR2 0x00000000 \
  CONFIG.USER_REG_ADDR_MADDR3 0x00000000 \
  CONFIG.USER_REG_ADDR_MADDR4 0x00000000 \
  CONFIG.USER_REG_ADDR_MADDR5 0x00000000 \
  CONFIG.USER_REG_ADDR_MADDR6 0x00000000 \
  CONFIG.USER_REG_ADDR_MADDR7 0x00000000 \
  CONFIG.USER_REG_ADDR_MADDR8 0x00000000 \
  CONFIG.USER_REG_ADDR_MADDR9 0x00000000 \
  CONFIG.USER_REG_ADDR_MADDR10 0x00000000 \
  CONFIG.USER_REG_ADDR_MADDR11 0x00000000 \
  CONFIG.USER_REG_ADDR_MADDR12 0x00000000 \
  CONFIG.USER_REG_ADDR_MADDR13 0x00000000 \
  CONFIG.USER_REG_ADDR_MADDR14 0x00000000 \
  CONFIG.USER_REG_ADDR_MADDR15 0x00000000 \
  CONFIG.USER_REG_ADDR_MASK0 0xffffffff \
  CONFIG.USER_REG_ADDR_MASK1 0xffffffff \
  CONFIG.USER_REG_ADDR_MASK2 0x00000000 \
  CONFIG.USER_REG_ADDR_MASK3 0x00000000 \
  CONFIG.USER_REG_ADDR_MASK4 0x00000000 \
  CONFIG.USER_REG_ADDR_MASK5 0x00000000 \
  CONFIG.USER_REG_ADDR_MASK6 0x00000000 \
  CONFIG.USER_REG_ADDR_MASK7 0x00000000 \
  CONFIG.USER_REG_ADDR_MASK8 0x00000000 \
  CONFIG.USER_REG_ADDR_MASK9 0x00000000 \
  CONFIG.USER_REG_ADDR_MASK10 0x00000000 \
  CONFIG.USER_REG_ADDR_MASK11 0x00000000 \
  CONFIG.USER_REG_ADDR_MASK12 0x00000000 \
  CONFIG.USER_REG_ADDR_MASK13 0x00000000 \
  CONFIG.USER_REG_ADDR_MASK14 0x00000000 \
  CONFIG.USER_REG_ADDR_MASK15 0x00000000 \
  CONFIG.USER_REG_ADDR_REMAP 0x0003 \
  CONFIG.USER_REG_ADDR_RPADDR0 0x02014000 \
  CONFIG.USER_REG_ADDR_RPADDR1 0x0201c000 \
  CONFIG.USER_REG_ADDR_RPADDR2 0x00000000 \
  CONFIG.USER_REG_ADDR_RPADDR3 0x00000000 \
  CONFIG.USER_REG_ADDR_RPADDR4 0x00000000 \
  CONFIG.USER_REG_ADDR_RPADDR5 0x00000000 \
  CONFIG.USER_REG_ADDR_RPADDR6 0x00000000 \
  CONFIG.USER_REG_ADDR_RPADDR7 0x00000000 \
  CONFIG.USER_REG_ADDR_RPADDR8 0x00000000 \
  CONFIG.USER_REG_ADDR_RPADDR9 0x00000000 \
  CONFIG.USER_REG_ADDR_RPADDR10 0x00000000 \
  CONFIG.USER_REG_ADDR_RPADDR11 0x00000000 \
  CONFIG.USER_REG_ADDR_RPADDR12 0x00000000 \
  CONFIG.USER_REG_ADDR_RPADDR13 0x00000000 \
  CONFIG.USER_REG_ADDR_RPADDR14 0x00000000 \
  CONFIG.USER_REG_ADDR_RPADDR15 0x00000000 \
  CONFIG.USER_REG_ADR_MAP_CPM 0xFC0 \
  CONFIG.USER_REG_ADR_MAP_FPD_AFI_0 0xFC0 \
  CONFIG.USER_REG_ADR_MAP_FPD_AFI_1 0xFC0 \
  CONFIG.USER_REG_ADR_MAP_LPD_AFI_FS 0xFC0 \
  CONFIG.USER_REG_ADR_MAP_ME_ARRAY_0 0xFC0 \
  CONFIG.USER_REG_ADR_MAP_ME_ARRAY_1 0xFC0 \
  CONFIG.USER_REG_ADR_MAP_ME_ARRAY_2 0xFC0 \
  CONFIG.USER_REG_ADR_MAP_ME_ARRAY_3 0xFC0 \
  CONFIG.USER_REG_ADR_MAP_PCIE 0xFC0 \
  CONFIG.USER_REG_ADR_MAP_PMC 0xFC0 \
  CONFIG.USER_REG_ADR_MAP_PMC_ALIAS_0 0xFC0 \
  CONFIG.USER_REG_ADR_MAP_PMC_ALIAS_1 0xFC0 \
  CONFIG.USER_REG_ADR_MAP_PMC_ALIAS_2 0xFC0 \
  CONFIG.USER_REG_ADR_MAP_PMC_ALIAS_3 0xFC0 \
  CONFIG.USER_REG_ADR_MAP_QSPI 0xFC0 \
  CONFIG.USER_REG_ADR_MAP_STM_GIC 0xFC0 \
  CONFIG.USER_REG_ADR_MAP_XPDS 0xFC0 \
  CONFIG.USER_REG_AXI_LOOPBACK 0x00 \
  CONFIG.USER_REG_AXI_NON_MOD_DISABLE 0x0 \
  CONFIG.USER_REG_AXI_PAR_CHK 0x0 \
  CONFIG.USER_REG_CHOPSIZE 0xA \
  CONFIG.USER_REG_DDR_ADR_MAP0 0x6000 \
  CONFIG.USER_REG_DDR_ADR_MAP1 0x1FFF \
  CONFIG.USER_REG_DDR_ADR_MAP2 0x1FFF \
  CONFIG.USER_REG_DDR_ADR_MAP3 0x1FFF \
  CONFIG.USER_REG_DDR_ADR_MAP4 0x1FFF \
  CONFIG.USER_REG_DDR_ADR_MAP5 0x1FFF \
  CONFIG.USER_REG_DDR_ADR_MAP6 0x1FFF \
  CONFIG.USER_REG_DDR_DST_MAP0 0x240 \
  CONFIG.USER_REG_DDR_DST_MAP1 0xFC0 \
  CONFIG.USER_REG_DDR_DST_MAP2 0xFC0 \
  CONFIG.USER_REG_DDR_DST_MAP3 0xFC0 \
  CONFIG.USER_REG_DDR_DST_MAP4 0xFC0 \
  CONFIG.USER_REG_DDR_DST_MAP5 0xFC0 \
  CONFIG.USER_REG_DDR_DST_MAP6 0xFC0 \
  CONFIG.USER_REG_DDR_DST_MAP7 0xFC0 \
  CONFIG.USER_REG_DWIDTH 0x4 \
  CONFIG.USER_REG_ECC_CHK_EN 0x1 \
  CONFIG.USER_REG_HBM_MAP_T0_CH0 0xFC0 \
  CONFIG.USER_REG_HBM_MAP_T0_CH1 0xFC0 \
  CONFIG.USER_REG_HBM_MAP_T0_CH2 0xFC0 \
  CONFIG.USER_REG_HBM_MAP_T0_CH3 0xFC0 \
  CONFIG.USER_REG_HBM_MAP_T0_CH4 0xFC0 \
  CONFIG.USER_REG_HBM_MAP_T0_CH5 0xFC0 \
  CONFIG.USER_REG_HBM_MAP_T0_CH6 0xFC0 \
  CONFIG.USER_REG_HBM_MAP_T0_CH7 0xFC0 \
  CONFIG.USER_REG_HBM_MAP_T0_CH8 0xFC0 \
  CONFIG.USER_REG_HBM_MAP_T0_CH9 0xFC0 \
  CONFIG.USER_REG_HBM_MAP_T0_CH10 0xFC0 \
  CONFIG.USER_REG_HBM_MAP_T0_CH11 0xFC0 \
  CONFIG.USER_REG_HBM_MAP_T0_CH12 0xFC0 \
  CONFIG.USER_REG_HBM_MAP_T0_CH13 0xFC0 \
  CONFIG.USER_REG_HBM_MAP_T0_CH14 0xFC0 \
  CONFIG.USER_REG_HBM_MAP_T0_CH15 0xFC0 \
  CONFIG.USER_REG_HBM_MAP_T1_CH0 0xFC0 \
  CONFIG.USER_REG_HBM_MAP_T1_CH1 0xFC0 \
  CONFIG.USER_REG_HBM_MAP_T1_CH2 0xFC0 \
  CONFIG.USER_REG_HBM_MAP_T1_CH3 0xFC0 \
  CONFIG.USER_REG_HBM_MAP_T1_CH4 0xFC0 \
  CONFIG.USER_REG_HBM_MAP_T1_CH5 0xFC0 \
  CONFIG.USER_REG_HBM_MAP_T1_CH6 0xFC0 \
  CONFIG.USER_REG_HBM_MAP_T1_CH7 0xFC0 \
  CONFIG.USER_REG_HBM_MAP_T1_CH8 0xFC0 \
  CONFIG.USER_REG_HBM_MAP_T1_CH9 0xFC0 \
  CONFIG.USER_REG_HBM_MAP_T1_CH10 0xFC0 \
  CONFIG.USER_REG_HBM_MAP_T1_CH11 0xFC0 \
  CONFIG.USER_REG_HBM_MAP_T1_CH12 0xFC0 \
  CONFIG.USER_REG_HBM_MAP_T1_CH13 0xFC0 \
  CONFIG.USER_REG_HBM_MAP_T1_CH14 0xFC0 \
  CONFIG.USER_REG_HBM_MAP_T1_CH15 0xFC0 \
  CONFIG.USER_REG_HBM_MAP_T2_CH0 0xFC0 \
  CONFIG.USER_REG_HBM_MAP_T2_CH1 0xFC0 \
  CONFIG.USER_REG_HBM_MAP_T2_CH2 0xFC0 \
  CONFIG.USER_REG_HBM_MAP_T2_CH3 0xFC0 \
  CONFIG.USER_REG_HBM_MAP_T2_CH4 0xFC0 \
  CONFIG.USER_REG_HBM_MAP_T2_CH5 0xFC0 \
  CONFIG.USER_REG_HBM_MAP_T2_CH6 0xFC0 \
  CONFIG.USER_REG_HBM_MAP_T2_CH7 0xFC0 \
  CONFIG.USER_REG_HBM_MAP_T2_CH8 0xFC0 \
  CONFIG.USER_REG_HBM_MAP_T2_CH9 0xFC0 \
  CONFIG.USER_REG_HBM_MAP_T2_CH10 0xFC0 \
  CONFIG.USER_REG_HBM_MAP_T2_CH11 0xFC0 \
  CONFIG.USER_REG_HBM_MAP_T2_CH12 0xFC0 \
  CONFIG.USER_REG_HBM_MAP_T2_CH13 0xFC0 \
  CONFIG.USER_REG_HBM_MAP_T2_CH14 0xFC0 \
  CONFIG.USER_REG_HBM_MAP_T2_CH15 0xFC0 \
  CONFIG.USER_REG_HBM_MAP_T3_CH0 0xFC0 \
  CONFIG.USER_REG_HBM_MAP_T3_CH1 0xFC0 \
  CONFIG.USER_REG_HBM_MAP_T3_CH2 0xFC0 \
  CONFIG.USER_REG_HBM_MAP_T3_CH3 0xFC0 \
  CONFIG.USER_REG_HBM_MAP_T3_CH4 0xFC0 \
  CONFIG.USER_REG_HBM_MAP_T3_CH5 0xFC0 \
  CONFIG.USER_REG_HBM_MAP_T3_CH6 0xFC0 \
  CONFIG.USER_REG_HBM_MAP_T3_CH7 0xFC0 \
  CONFIG.USER_REG_HBM_MAP_T3_CH8 0xFC0 \
  CONFIG.USER_REG_HBM_MAP_T3_CH9 0xFC0 \
  CONFIG.USER_REG_HBM_MAP_T3_CH10 0xFC0 \
  CONFIG.USER_REG_HBM_MAP_T3_CH11 0xFC0 \
  CONFIG.USER_REG_HBM_MAP_T3_CH12 0xFC0 \
  CONFIG.USER_REG_HBM_MAP_T3_CH13 0xFC0 \
  CONFIG.USER_REG_HBM_MAP_T3_CH14 0xFC0 \
  CONFIG.USER_REG_HBM_MAP_T3_CH15 0xFC0 \
  CONFIG.USER_REG_MODE_SELECT 0x0000 \
  CONFIG.USER_REG_OUTSTANDING_RD_TXN 0x40 \
  CONFIG.USER_REG_OUTSTANDING_WR_TXN 0x40 \
  CONFIG.USER_REG_PRIORITY 0x0 \
  CONFIG.USER_REG_RD_AXPROT_SEL 0x00 \
  CONFIG.USER_REG_RD_RATE_CREDIT_DROP 0x004 \
  CONFIG.USER_REG_RD_RATE_CREDIT_LIMIT 0x0100 \
  CONFIG.USER_REG_RD_VCA_TOKEN0 0x2B \
  CONFIG.USER_REG_RPOISON_TO_SLVERR 0x0 \
  CONFIG.USER_REG_RROB_RAM_SETTING 0x012 \
  CONFIG.USER_REG_SMID_SEL 0x00000 \
  CONFIG.USER_REG_SRC 0x140 \
  CONFIG.USER_REG_TBASE_AXI_TIMEOUT 0x1 \
  CONFIG.USER_REG_TBASE_MODE_RLIMIT_RD 0x2 \
  CONFIG.USER_REG_TBASE_MODE_RLIMIT_WR 0x2 \
  CONFIG.USER_REG_TBASE_TRK_TIMEOUT 0x1 \
  CONFIG.USER_REG_VC_MAP 0xFAC \
  CONFIG.USER_REG_WBUF_LAUNCH_SIZE 0x10 \
  CONFIG.USER_REG_WBUF_RAM_SETTING 0x012 \
  CONFIG.USER_REG_WR_AXPROT_SEL 0x00 \
  CONFIG.USER_REG_WR_RATE_CREDIT_DROP 0x004 \
  CONFIG.USER_REG_WR_RATE_CREDIT_LIMIT 0x0100 \
  CONFIG.USER_REG_WR_VCA_TOKEN0 0xFF \
] [get_bd_cells S02_AXI_nmu]
create_bd_cell -type ip -vlnv xilinx.com:ip:noc_nmu:1.0 S01_AXI_rpu
set_property -dict [list \
  CONFIG.ATTR_FILE nocattrs.dat \
  CONFIG.NOC_FREQ 1000 \
  CONFIG.USER_NOC_CATEGORY PS \
  CONFIG.USER_NOC_DATA512_WIDTH 128 \
  CONFIG.USER_NOC_NMU_WIDTH 128 \
  CONFIG.USER_PHYS_NAME NOC_NMU128_X0Y3 \
  CONFIG.USER_REG_ADDR_DST0 0x0000 \
  CONFIG.USER_REG_ADDR_DST1 0x0000 \
  CONFIG.USER_REG_ADDR_DST2 0x0000 \
  CONFIG.USER_REG_ADDR_DST3 0x0000 \
  CONFIG.USER_REG_ADDR_DST4 0x0000 \
  CONFIG.USER_REG_ADDR_DST5 0x0000 \
  CONFIG.USER_REG_ADDR_DST6 0x0000 \
  CONFIG.USER_REG_ADDR_DST7 0x0000 \
  CONFIG.USER_REG_ADDR_DST8 0x0000 \
  CONFIG.USER_REG_ADDR_DST9 0x0000 \
  CONFIG.USER_REG_ADDR_DST10 0x0000 \
  CONFIG.USER_REG_ADDR_DST11 0x0000 \
  CONFIG.USER_REG_ADDR_DST12 0x0000 \
  CONFIG.USER_REG_ADDR_DST13 0x0000 \
  CONFIG.USER_REG_ADDR_DST14 0x0000 \
  CONFIG.USER_REG_ADDR_DST15 0x0000 \
  CONFIG.USER_REG_ADDR_ENABLE 0x0000 \
  CONFIG.USER_REG_ADDR_MADDR0 0x00000000 \
  CONFIG.USER_REG_ADDR_MADDR1 0x00000000 \
  CONFIG.USER_REG_ADDR_MADDR2 0x00000000 \
  CONFIG.USER_REG_ADDR_MADDR3 0x00000000 \
  CONFIG.USER_REG_ADDR_MADDR4 0x00000000 \
  CONFIG.USER_REG_ADDR_MADDR5 0x00000000 \
  CONFIG.USER_REG_ADDR_MADDR6 0x00000000 \
  CONFIG.USER_REG_ADDR_MADDR7 0x00000000 \
  CONFIG.USER_REG_ADDR_MADDR8 0x00000000 \
  CONFIG.USER_REG_ADDR_MADDR9 0x00000000 \
  CONFIG.USER_REG_ADDR_MADDR10 0x00000000 \
  CONFIG.USER_REG_ADDR_MADDR11 0x00000000 \
  CONFIG.USER_REG_ADDR_MADDR12 0x00000000 \
  CONFIG.USER_REG_ADDR_MADDR13 0x00000000 \
  CONFIG.USER_REG_ADDR_MADDR14 0x00000000 \
  CONFIG.USER_REG_ADDR_MADDR15 0x00000000 \
  CONFIG.USER_REG_ADDR_MASK0 0x00000000 \
  CONFIG.USER_REG_ADDR_MASK1 0x00000000 \
  CONFIG.USER_REG_ADDR_MASK2 0x00000000 \
  CONFIG.USER_REG_ADDR_MASK3 0x00000000 \
  CONFIG.USER_REG_ADDR_MASK4 0x00000000 \
  CONFIG.USER_REG_ADDR_MASK5 0x00000000 \
  CONFIG.USER_REG_ADDR_MASK6 0x00000000 \
  CONFIG.USER_REG_ADDR_MASK7 0x00000000 \
  CONFIG.USER_REG_ADDR_MASK8 0x00000000 \
  CONFIG.USER_REG_ADDR_MASK9 0x00000000 \
  CONFIG.USER_REG_ADDR_MASK10 0x00000000 \
  CONFIG.USER_REG_ADDR_MASK11 0x00000000 \
  CONFIG.USER_REG_ADDR_MASK12 0x00000000 \
  CONFIG.USER_REG_ADDR_MASK13 0x00000000 \
  CONFIG.USER_REG_ADDR_MASK14 0x00000000 \
  CONFIG.USER_REG_ADDR_MASK15 0x00000000 \
  CONFIG.USER_REG_ADDR_REMAP 0x0000 \
  CONFIG.USER_REG_ADDR_RPADDR0 0x00000000 \
  CONFIG.USER_REG_ADDR_RPADDR1 0x00000000 \
  CONFIG.USER_REG_ADDR_RPADDR2 0x00000000 \
  CONFIG.USER_REG_ADDR_RPADDR3 0x00000000 \
  CONFIG.USER_REG_ADDR_RPADDR4 0x00000000 \
  CONFIG.USER_REG_ADDR_RPADDR5 0x00000000 \
  CONFIG.USER_REG_ADDR_RPADDR6 0x00000000 \
  CONFIG.USER_REG_ADDR_RPADDR7 0x00000000 \
  CONFIG.USER_REG_ADDR_RPADDR8 0x00000000 \
  CONFIG.USER_REG_ADDR_RPADDR9 0x00000000 \
  CONFIG.USER_REG_ADDR_RPADDR10 0x00000000 \
  CONFIG.USER_REG_ADDR_RPADDR11 0x00000000 \
  CONFIG.USER_REG_ADDR_RPADDR12 0x00000000 \
  CONFIG.USER_REG_ADDR_RPADDR13 0x00000000 \
  CONFIG.USER_REG_ADDR_RPADDR14 0x00000000 \
  CONFIG.USER_REG_ADDR_RPADDR15 0x00000000 \
  CONFIG.USER_REG_ADR_MAP_CPM 0xFC0 \
  CONFIG.USER_REG_ADR_MAP_FPD_AFI_0 0xFC0 \
  CONFIG.USER_REG_ADR_MAP_FPD_AFI_1 0xFC0 \
  CONFIG.USER_REG_ADR_MAP_LPD_AFI_FS 0xFC0 \
  CONFIG.USER_REG_ADR_MAP_ME_ARRAY_0 0xFC0 \
  CONFIG.USER_REG_ADR_MAP_ME_ARRAY_1 0xFC0 \
  CONFIG.USER_REG_ADR_MAP_ME_ARRAY_2 0xFC0 \
  CONFIG.USER_REG_ADR_MAP_ME_ARRAY_3 0xFC0 \
  CONFIG.USER_REG_ADR_MAP_PCIE 0xFC0 \
  CONFIG.USER_REG_ADR_MAP_PMC 0xFC0 \
  CONFIG.USER_REG_ADR_MAP_PMC_ALIAS_0 0xFC0 \
  CONFIG.USER_REG_ADR_MAP_PMC_ALIAS_1 0xFC0 \
  CONFIG.USER_REG_ADR_MAP_PMC_ALIAS_2 0xFC0 \
  CONFIG.USER_REG_ADR_MAP_PMC_ALIAS_3 0xFC0 \
  CONFIG.USER_REG_ADR_MAP_QSPI 0xFC0 \
  CONFIG.USER_REG_ADR_MAP_STM_GIC 0xFC0 \
  CONFIG.USER_REG_ADR_MAP_XPDS 0xFC0 \
  CONFIG.USER_REG_AXI_LOOPBACK 0x00 \
  CONFIG.USER_REG_AXI_NON_MOD_DISABLE 0x0 \
  CONFIG.USER_REG_AXI_PAR_CHK 0x0 \
  CONFIG.USER_REG_CHOPSIZE 0xA \
  CONFIG.USER_REG_DDR_ADR_MAP0 0x6000 \
  CONFIG.USER_REG_DDR_ADR_MAP1 0x1FFF \
  CONFIG.USER_REG_DDR_ADR_MAP2 0x1FFF \
  CONFIG.USER_REG_DDR_ADR_MAP3 0x1FFF \
  CONFIG.USER_REG_DDR_ADR_MAP4 0x1FFF \
  CONFIG.USER_REG_DDR_ADR_MAP5 0x1FFF \
  CONFIG.USER_REG_DDR_ADR_MAP6 0x1FFF \
  CONFIG.USER_REG_DDR_DST_MAP0 0x240 \
  CONFIG.USER_REG_DDR_DST_MAP1 0xFC0 \
  CONFIG.USER_REG_DDR_DST_MAP2 0xFC0 \
  CONFIG.USER_REG_DDR_DST_MAP3 0xFC0 \
  CONFIG.USER_REG_DDR_DST_MAP4 0xFC0 \
  CONFIG.USER_REG_DDR_DST_MAP5 0xFC0 \
  CONFIG.USER_REG_DDR_DST_MAP6 0xFC0 \
  CONFIG.USER_REG_DDR_DST_MAP7 0xFC0 \
  CONFIG.USER_REG_DWIDTH 0x4 \
  CONFIG.USER_REG_ECC_CHK_EN 0x1 \
  CONFIG.USER_REG_HBM_MAP_T0_CH0 0xFC0 \
  CONFIG.USER_REG_HBM_MAP_T0_CH1 0xFC0 \
  CONFIG.USER_REG_HBM_MAP_T0_CH2 0xFC0 \
  CONFIG.USER_REG_HBM_MAP_T0_CH3 0xFC0 \
  CONFIG.USER_REG_HBM_MAP_T0_CH4 0xFC0 \
  CONFIG.USER_REG_HBM_MAP_T0_CH5 0xFC0 \
  CONFIG.USER_REG_HBM_MAP_T0_CH6 0xFC0 \
  CONFIG.USER_REG_HBM_MAP_T0_CH7 0xFC0 \
  CONFIG.USER_REG_HBM_MAP_T0_CH8 0xFC0 \
  CONFIG.USER_REG_HBM_MAP_T0_CH9 0xFC0 \
  CONFIG.USER_REG_HBM_MAP_T0_CH10 0xFC0 \
  CONFIG.USER_REG_HBM_MAP_T0_CH11 0xFC0 \
  CONFIG.USER_REG_HBM_MAP_T0_CH12 0xFC0 \
  CONFIG.USER_REG_HBM_MAP_T0_CH13 0xFC0 \
  CONFIG.USER_REG_HBM_MAP_T0_CH14 0xFC0 \
  CONFIG.USER_REG_HBM_MAP_T0_CH15 0xFC0 \
  CONFIG.USER_REG_HBM_MAP_T1_CH0 0xFC0 \
  CONFIG.USER_REG_HBM_MAP_T1_CH1 0xFC0 \
  CONFIG.USER_REG_HBM_MAP_T1_CH2 0xFC0 \
  CONFIG.USER_REG_HBM_MAP_T1_CH3 0xFC0 \
  CONFIG.USER_REG_HBM_MAP_T1_CH4 0xFC0 \
  CONFIG.USER_REG_HBM_MAP_T1_CH5 0xFC0 \
  CONFIG.USER_REG_HBM_MAP_T1_CH6 0xFC0 \
  CONFIG.USER_REG_HBM_MAP_T1_CH7 0xFC0 \
  CONFIG.USER_REG_HBM_MAP_T1_CH8 0xFC0 \
  CONFIG.USER_REG_HBM_MAP_T1_CH9 0xFC0 \
  CONFIG.USER_REG_HBM_MAP_T1_CH10 0xFC0 \
  CONFIG.USER_REG_HBM_MAP_T1_CH11 0xFC0 \
  CONFIG.USER_REG_HBM_MAP_T1_CH12 0xFC0 \
  CONFIG.USER_REG_HBM_MAP_T1_CH13 0xFC0 \
  CONFIG.USER_REG_HBM_MAP_T1_CH14 0xFC0 \
  CONFIG.USER_REG_HBM_MAP_T1_CH15 0xFC0 \
  CONFIG.USER_REG_HBM_MAP_T2_CH0 0xFC0 \
  CONFIG.USER_REG_HBM_MAP_T2_CH1 0xFC0 \
  CONFIG.USER_REG_HBM_MAP_T2_CH2 0xFC0 \
  CONFIG.USER_REG_HBM_MAP_T2_CH3 0xFC0 \
  CONFIG.USER_REG_HBM_MAP_T2_CH4 0xFC0 \
  CONFIG.USER_REG_HBM_MAP_T2_CH5 0xFC0 \
  CONFIG.USER_REG_HBM_MAP_T2_CH6 0xFC0 \
  CONFIG.USER_REG_HBM_MAP_T2_CH7 0xFC0 \
  CONFIG.USER_REG_HBM_MAP_T2_CH8 0xFC0 \
  CONFIG.USER_REG_HBM_MAP_T2_CH9 0xFC0 \
  CONFIG.USER_REG_HBM_MAP_T2_CH10 0xFC0 \
  CONFIG.USER_REG_HBM_MAP_T2_CH11 0xFC0 \
  CONFIG.USER_REG_HBM_MAP_T2_CH12 0xFC0 \
  CONFIG.USER_REG_HBM_MAP_T2_CH13 0xFC0 \
  CONFIG.USER_REG_HBM_MAP_T2_CH14 0xFC0 \
  CONFIG.USER_REG_HBM_MAP_T2_CH15 0xFC0 \
  CONFIG.USER_REG_HBM_MAP_T3_CH0 0xFC0 \
  CONFIG.USER_REG_HBM_MAP_T3_CH1 0xFC0 \
  CONFIG.USER_REG_HBM_MAP_T3_CH2 0xFC0 \
  CONFIG.USER_REG_HBM_MAP_T3_CH3 0xFC0 \
  CONFIG.USER_REG_HBM_MAP_T3_CH4 0xFC0 \
  CONFIG.USER_REG_HBM_MAP_T3_CH5 0xFC0 \
  CONFIG.USER_REG_HBM_MAP_T3_CH6 0xFC0 \
  CONFIG.USER_REG_HBM_MAP_T3_CH7 0xFC0 \
  CONFIG.USER_REG_HBM_MAP_T3_CH8 0xFC0 \
  CONFIG.USER_REG_HBM_MAP_T3_CH9 0xFC0 \
  CONFIG.USER_REG_HBM_MAP_T3_CH10 0xFC0 \
  CONFIG.USER_REG_HBM_MAP_T3_CH11 0xFC0 \
  CONFIG.USER_REG_HBM_MAP_T3_CH12 0xFC0 \
  CONFIG.USER_REG_HBM_MAP_T3_CH13 0xFC0 \
  CONFIG.USER_REG_HBM_MAP_T3_CH14 0xFC0 \
  CONFIG.USER_REG_HBM_MAP_T3_CH15 0xFC0 \
  CONFIG.USER_REG_MODE_SELECT 0x0000 \
  CONFIG.USER_REG_OUTSTANDING_RD_TXN 0x40 \
  CONFIG.USER_REG_OUTSTANDING_WR_TXN 0x40 \
  CONFIG.USER_REG_PRIORITY 0x0 \
  CONFIG.USER_REG_RD_AXPROT_SEL 0x00 \
  CONFIG.USER_REG_RD_RATE_CREDIT_DROP 0x004 \
  CONFIG.USER_REG_RD_RATE_CREDIT_LIMIT 0x0100 \
  CONFIG.USER_REG_RD_VCA_TOKEN0 0x2B \
  CONFIG.USER_REG_RPOISON_TO_SLVERR 0x0 \
  CONFIG.USER_REG_RROB_RAM_SETTING 0x012 \
  CONFIG.USER_REG_SMID_SEL 0x00000 \
  CONFIG.USER_REG_SRC 0x100 \
  CONFIG.USER_REG_TBASE_AXI_TIMEOUT 0x1 \
  CONFIG.USER_REG_TBASE_MODE_RLIMIT_RD 0x2 \
  CONFIG.USER_REG_TBASE_MODE_RLIMIT_WR 0x2 \
  CONFIG.USER_REG_TBASE_TRK_TIMEOUT 0x1 \
  CONFIG.USER_REG_VC_MAP 0xFAC \
  CONFIG.USER_REG_WBUF_LAUNCH_SIZE 0x10 \
  CONFIG.USER_REG_WBUF_RAM_SETTING 0x012 \
  CONFIG.USER_REG_WR_AXPROT_SEL 0x00 \
  CONFIG.USER_REG_WR_RATE_CREDIT_DROP 0x004 \
  CONFIG.USER_REG_WR_RATE_CREDIT_LIMIT 0x0100 \
  CONFIG.USER_REG_WR_VCA_TOKEN0 0xFF \
] [get_bd_cells S01_AXI_rpu]
create_bd_cell -type ip -vlnv xilinx.com:ip:noc_nmu:1.0 S03_AXI_nmu
